# EasyEDA Pro project ProProject_Hauptplatine_ESP32.epro, board PCB1_Link
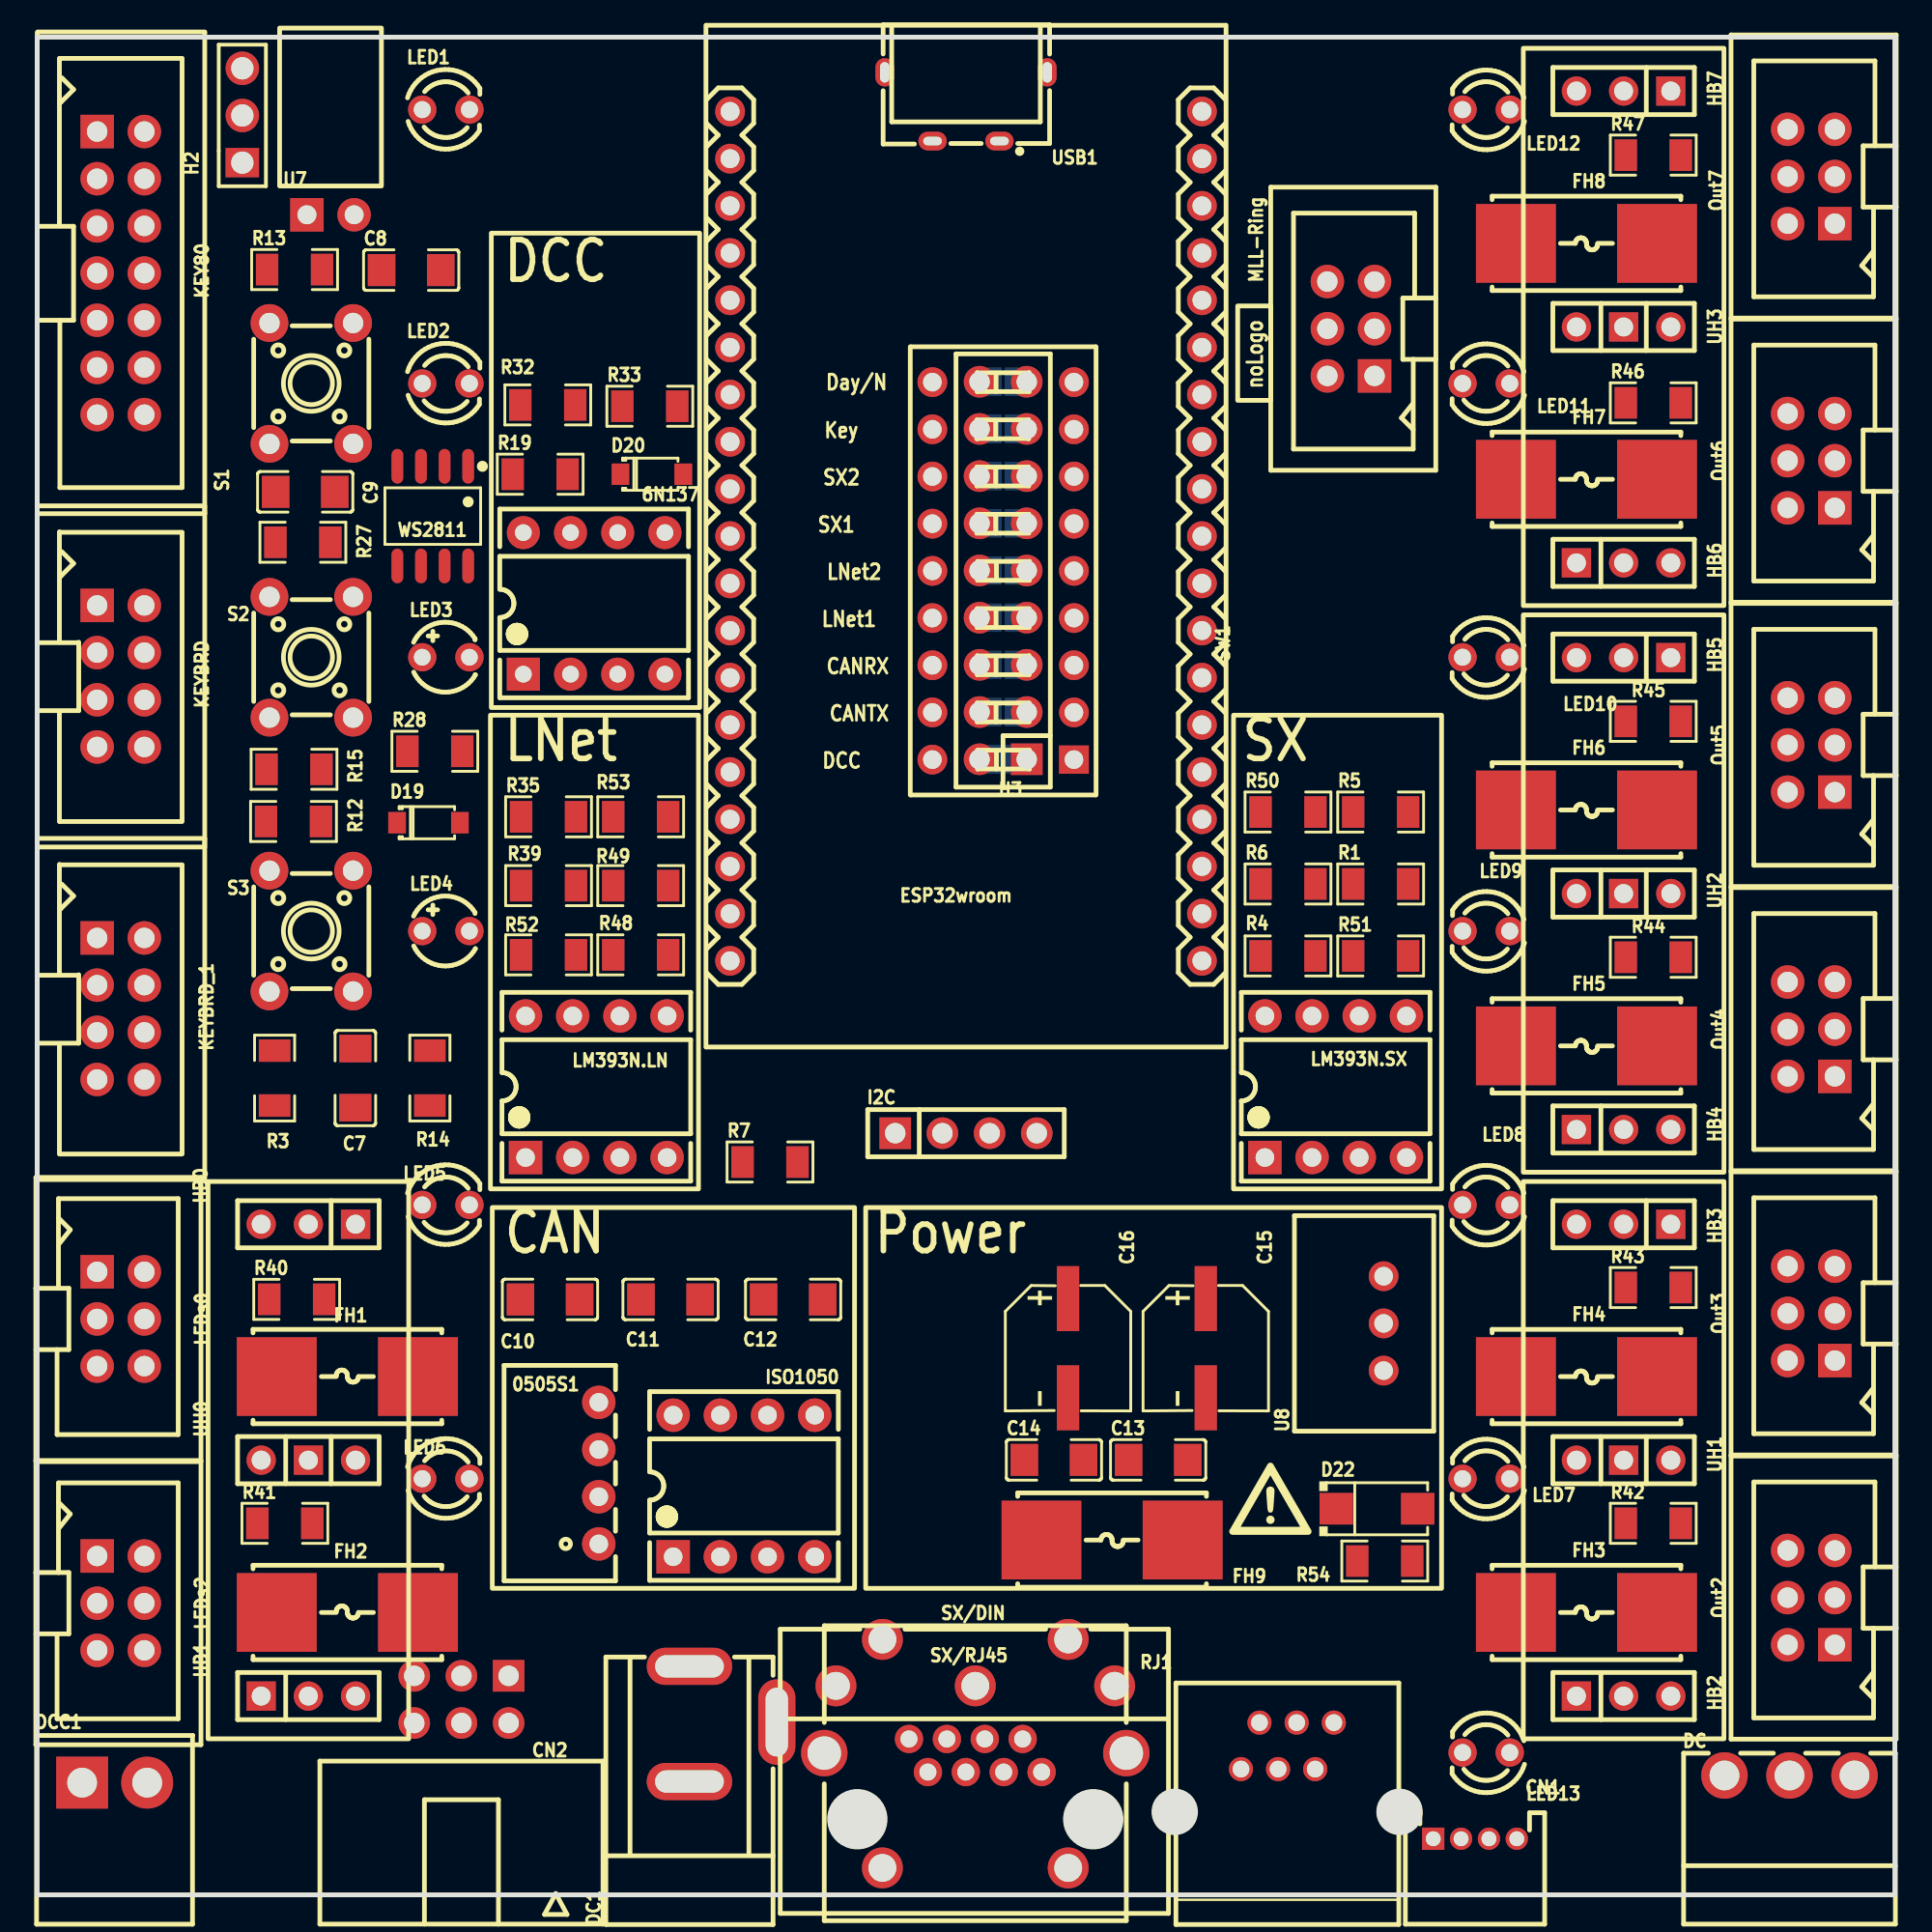
[diagram p10: board, top side]
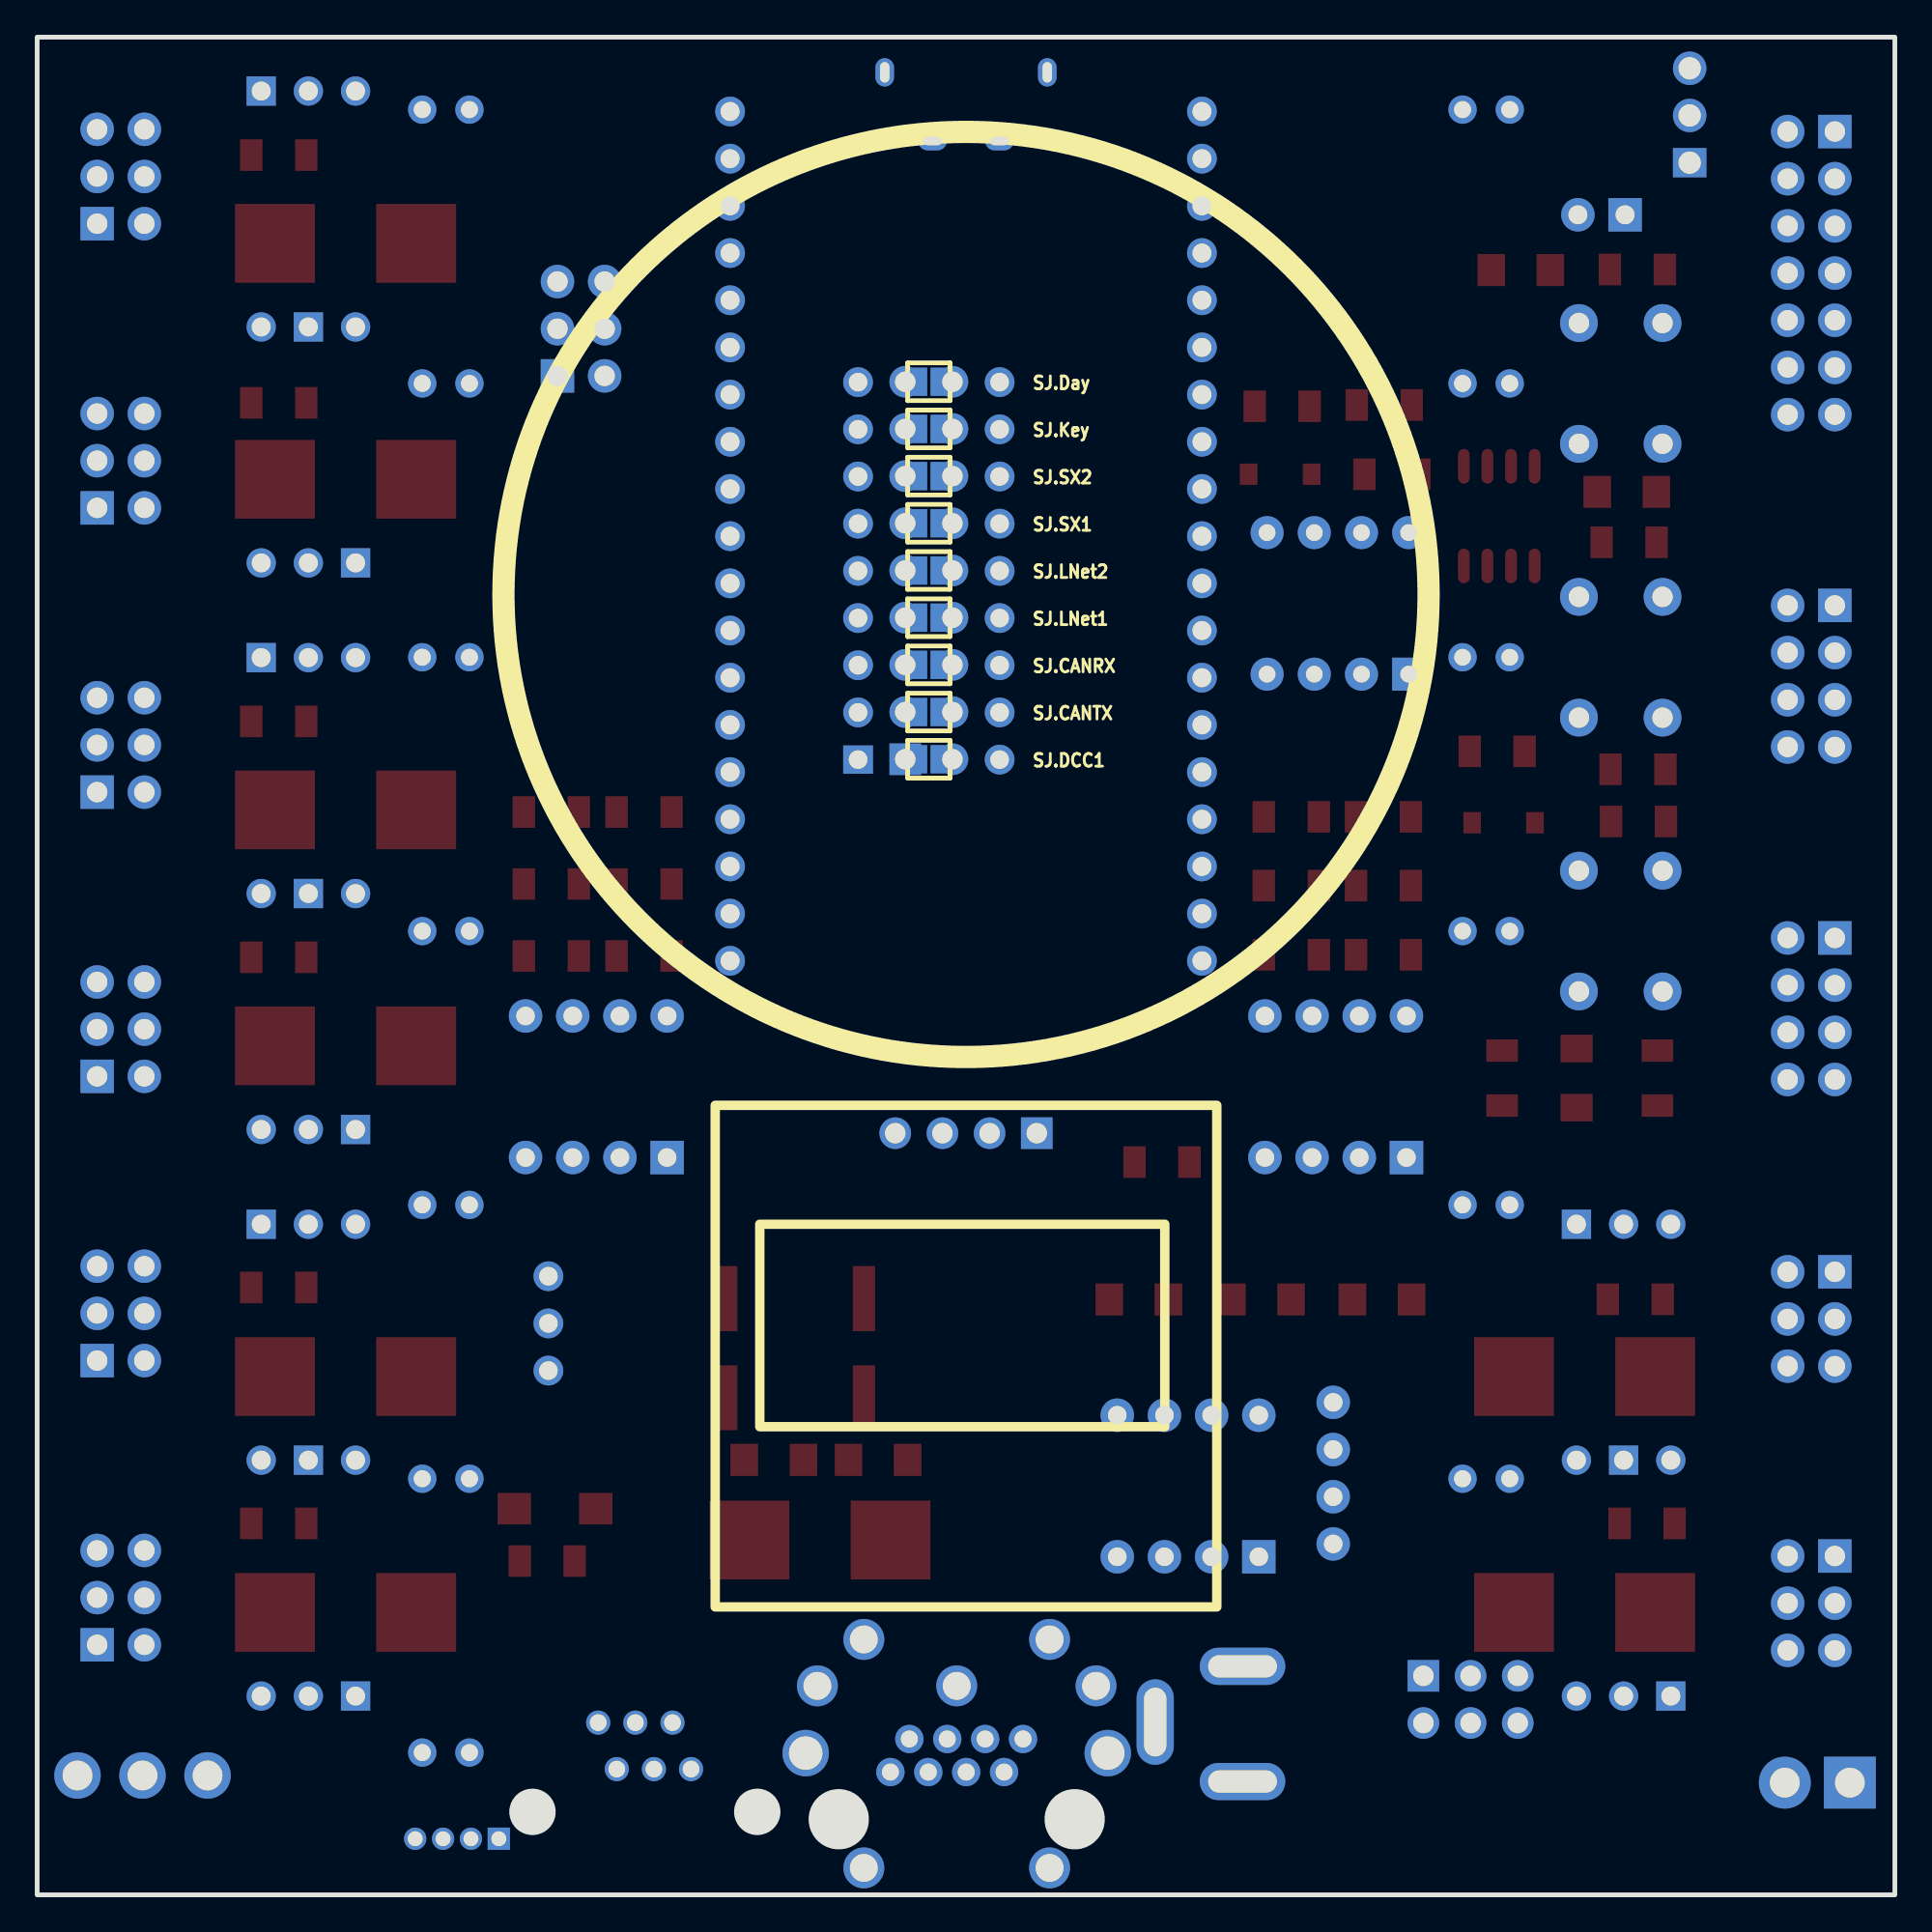
[diagram p11: board, bottom side, seen from below]

Outline 100 x 100 mm; copper layers: Top Layer, Bottom Layer. Coordinates in mm from the lower left corner of the outline.
Outline path: rectangle 0,100 100,0
Stack: Top Layer 0.035mm / Dielectric1 1.51mm FR4 er 4.5 / Bottom Layer 0.035mm

## Design rules (mm)
template: copperThickness1oz
spacing copperThickness1oz (default): track to track 0.132, other pairs 0.152 to 0.3
spacing copperThickness2oz: track to track 0.203, other pairs 0.152 to 0.3
track width copperThickness1oz (default): min 0.127, default 0.254, max 2.54
track width copperThickness2oz: min 0.203, default 0.254, max 2.54
differential pair differentialPair (default): width min 0.127, default 0.254, max 2.54; gap min 0.152, default 0.152
via viaSize (default): diameter min 0.5, default 0.61, max 10; hole min 0.3, default 0.305, max 6.299

## Placement (name value [footprint] x y rotation side)
6N137  6N137  [DIP-8_L9.8-W6.6-P2.54-LS7.6-BL]  29.98 69.52 0 top
0505S1  B0505S-W5R3  [PWRM-TH_BXXXXS-1WR3]  30.23 22.7 90 top
C7  1uF  [C1206]  17.13 43.97 90 top
C8  1uF  [C1206]  20.13 87.46 0 top
C9  1uF  [C1206]  14.43 75.52 180 top
C10  4.7uF  [C1206]  27.61 32.05 180 top
C11  4.7uF  [C1206]  34.09 32.05 180 top
C12  100nF  [C1206]  40.69 32.05 180 top
C13  100uF  [C1206]  60.34 23.41 0 top
C14  100uF  [C1206]  54.73 23.41 0 top
C15  100uF  [CAP-SMD_BD6.3-L6.6-W6.6-FD]  62.91 29.43 270 top
C16  100uF  [CAP-SMD_BD6.3-L6.6-W6.6-FD]  55.49 29.43 270 top
CN1  S4B-ZR(LF)(SN)  [CONN-TH_S4B-ZR-LF-SN]  77.4 3.02 0 top
CN2  2.54-2*3P弯简牛  [IDC-TH_6P-P2.54-H-R2-C3-S2.54]  22.84 10.52 0 top
D19  1N5819W  [SOD-123_L2.8-W1.8-LS3.7-RD]  21.06 57.71 0 top
D20  1N5819W  [SOD-123_L2.8-W1.8-LS3.7-RD]  33.09 76.47 0 top
D22  1N5819  [SMA_L4.4-W2.6-LS5.0-RD]  72.12 20.78 0 top
DC  DB2ERC-3.5-3P-GN  [CONN-TH_3P-P3.50_DB2ERC-3.5-3P-GN]  94.33 6.43 0 top
DC1  DC005  [DC-IN-TH_DC005]  37.46 9.2 90 top
DCC1  DB2ERC-3.5-2P-GN  [CONN-TH_2P-P3.50_DB2ERC-3.5-2P]  4.17 6.04 0 top
ESP32wroom  ESP32-DevKitC  [BULETM-SMD_ESP32-DEVKITC]  50 73.14 90 top
FH1  01550900M  [FUSE-SMD_L9.8-W5.0]  16.7 27.9 180 top
FH2  01550900M  [FUSE-SMD_L9.8-W5.0]  16.7 15.2 180 top
FH3  01550900M  [FUSE-SMD_L9.8-W5.0]  83.4 15.2 0 top
FH4  01550900M  [FUSE-SMD_L9.8-W5.0]  83.4 27.9 0 top
FH5  01550900M  [FUSE-SMD_L9.8-W5.0]  83.4 45.7 0 top
FH6  01550900M  [FUSE-SMD_L9.8-W5.0]  83.4 58.4 0 top
FH7  01550900M  [FUSE-SMD_L9.8-W5.0]  83.4 76.2 0 top
FH8  01550900M  [FUSE-SMD_L9.8-W5.0]  83.4 88.9 0 top
FH9  01550900M  [FUSE-SMD_L9.8-W5.0]  57.86 19.1 0 top
H2  2.54-1*3P针  [HDR-TH_3P-P2.54-V-M-1]  11.04 95.78 90 top
H3  X6521WV-2x09H-C60D30  [HDR-TH_18P-P2.54-V-M-R2-C9-S2.54]  52 71.29 90 top
HB0  PM2.54-1*3  [HDR-TH_3P-P2.54-V-F#2]  14.6 36.1 180 top
HB1  PM2.54-1*3  [HDR-TH_3P-P2.54-V-F#2]  14.6 10.7 0 top
HB2  PM2.54-1*3  [HDR-TH_3P-P2.54-V-F#2]  85.4 10.7 0 top
HB3  PM2.54-1*3  [HDR-TH_3P-P2.54-V-F#2]  85.4 36.1 180 top
HB4  PM2.54-1*3  [HDR-TH_3P-P2.54-V-F#2]  85.4 41.2 0 top
HB5  PM2.54-1*3  [HDR-TH_3P-P2.54-V-F#2]  85.4 66.6 180 top
HB6  PM2.54-1*3  [HDR-TH_3P-P2.54-V-F#2]  85.4 71.7 0 top
HB7  PM2.54-1*3  [HDR-TH_3P-P2.54-V-F#2]  85.4 97.1 180 top
I2C  2.54-1*4P母  [HDR-TH_4P-P2.54-V-F]  50 41 0 top
ISO1050  ISO1050DUBR  [SOIC-8_L9.3-W6.6-P2.54-LS10.4-BL]  38.05 22.01 0 top
KEY80  KEY80  [IDC-TH_14P-P2.54-V-R2-C7-S2.54]  4.5 87.3 270 top
KEYBRD  KEYBRD  [IDC-TH_8P-P2.54-V-R2-C4-S2.54]  4.5 65.6 270 top
KEYBRD_1  KEYBRD_1  [IDC-TH_8P-P2.54-V-R2-C4-S2.54]  4.5 47.7 270 top
LED1  Heartbeat  [LED-TH_BD3.0-P2.54-FD-GREEN]  22 96.1 0 top
LED2  gelb  [LED-TH_BD3.0-P2.54-FD_YELLOW]  22 81.36 0 top
LED3  weiss  [LED-TH_BD3.8-P2.54-FD_WHITE]  22 66.62 0 top
LED4  blau  [LED-TH_BD3.8-P2.54-FD_BLUE]  22 51.88 0 top
LED5  gelb  [LED-TH_BD3.0-P2.54-FD]  22 37.14 0 top
LED6  gelb  [LED-TH_BD3.0-P2.54-FD]  22 22.4 0 top
LED7  gelb  [LED-TH_BD3.0-P2.54-FD]  78 22.4 180 top
LED8  gelb  [LED-TH_BD3.0-P2.54-FD]  78 37.14 180 top
LED9  gelb  [LED-TH_BD3.0-P2.54-FD]  78 51.88 180 top
LED10  gelb  [LED-TH_BD3.0-P2.54-FD]  78 66.62 180 top
LED11  gelb  [LED-TH_BD3.0-P2.54-FD]  78 81.36 180 top
LED12  gelb  [LED-TH_BD3.0-P2.54-FD]  78 96.1 180 top
LED13  gelb  [LED-TH_BD3.0-P2.54-FD]  78 7.66 180 top
LEDs0  BH254V-6P  [IDC-TH_6P-P2.54-V-R2-C3-S2.54]  4.5 31 270 top
LEDs2  BH254V-6P  [IDC-TH_6P-P2.54-V-R2-C3-S2.54]  4.5 15.7 270 top
LM393N.LN  LM393N  [DIP-8_L9.7-W6.4-P2.54-LS7.6-BL]  30.1 43.5 0 top
LM393N.SX  LM393N  [DIP-8_L9.7-W6.4-P2.54-LS7.6-BL]  69.9 43.5 0 top
MLL-Ring  BH254V-6P  [IDC-TH_6P-P2.54-V-R2-C3-S2.54]  70.72 84.31 90 top
Out2  BH254V-6P  [IDC-TH_6P-P2.54-V-R2-C3-S2.54]  95.5 16 90 top
Out3  BH254V-6P  [IDC-TH_6P-P2.54-V-R2-C3-S2.54]  95.5 31.3 90 top
Out4  BH254V-6P  [IDC-TH_6P-P2.54-V-R2-C3-S2.54]  95.5 46.6 90 top
Out5  BH254V-6P  [IDC-TH_6P-P2.54-V-R2-C3-S2.54]  95.5 61.9 90 top
Out6  BH254V-6P  [IDC-TH_6P-P2.54-V-R2-C3-S2.54]  95.5 77.2 90 top
Out7  BH254V-6P  [IDC-TH_6P-P2.54-V-R2-C3-S2.54]  95.5 92.5 90 top
R1  22kΩ  [R1206]  72.32 54.41 0 top
R3  470Ω  [R1206]  12.78 43.97 90 top
R4  8.2kΩ  [R1206]  67.33 50.54 0 top
R5  22kΩ  [R1206]  72.32 58.29 0 top
R6  8.2kΩ  [R1206]  67.33 54.41 0 top
R7  4.7kΩ  [R1206]  39.45 39.45 0 top
R12  100Ω  [R1206]  13.8 57.78 0 top
R13  4.7kΩ  [R1206]  13.86 87.49 0 top
R14  22kΩ  [R1206]  21.14 43.97 90 top
R15  100Ω  [R1206]  13.83 60.59 180 top
R19  1kΩ  [R1206]  27.08 76.47 0 top
R27  22kΩ  [R1206]  14.3 72.81 180 top
R28  100Ω  [R1206]  21.41 61.56 0 top
R32  1kΩ  [R1206]  27.49 80.2 0 top
R33  2kΩ  [R1206]  32.98 80.13 0 top
R35  8.2kΩ  [R1206]  27.53 58.03 0 top
R39  22kΩ  [R1206]  27.53 54.33 0 top
R40  1kΩ  [R1206]  13.97 32.06 0 top
R41  1kΩ  [R1206]  13.33 20 0 top
R42  1kΩ  [R1206]  87 20 0 top
R43  1kΩ  [R1206]  87 32.69 0 top
R44  1kΩ  [R1206]  87 50.47 0 top
R45  1kΩ  [R1206]  87 63.17 0 top
R46  1kΩ  [R1206]  87 80.31 0 top
R47  1kΩ  [R1206]  87 93.65 0 top
R48  47kΩ  [R1206]  32.49 50.6 0 top
R49  10kΩ  [R1206]  32.49 54.33 0 top
R50  33kΩ  [R1206]  67.33 58.29 0 top
R51  33kΩ  [R1206]  72.32 50.54 0 top
R52  150kΩ  [R1206]  27.53 50.6 0 top
R53  220kΩ  [R1206]  32.49 58.03 0 top
R54  1kΩ  [R1206]  72.54 17.97 0 top
RJ1  DS1133-S60BPX  [RJ11-TH_DS1133-S60BPX]  67.3 8.02 90 top
S1  K2-1102DP-X4SW-04  [KEY-TH_4P-L6.2-W6.2-P4.50-LS6.5]  14.76 81.36 90 top
S2  K2-1102DP-X4SW-04  [KEY-TH_4P-L6.2-W6.2-P4.50-LS6.5]  14.76 66.62 90 top
S3  K2-1102DP-X4SW-04  [KEY-TH_4P-L6.2-W6.2-P4.50-LS6.5]  14.76 51.88 90 top
SJ.CANRX  SJ_1.27  [SMD_2P-P1.27-SJ]  52 66.21 180 bottom
SJ.CANTX  SJ_1.27  [SMD_2P-P1.27-SJ]  52 63.67 180 bottom
SJ.Day  SJ_1.27  [SMD_2P-P1.27-SJ]  52 81.45 180 bottom
SJ.DCC1  SJ_1.27  [SMD_2P-P1.27-SJ]  52 61.13 180 bottom
SJ.Key  SJ_1.27  [SMD_2P-P1.27-SJ]  52 78.91 180 bottom
SJ.LNet1  SJ_1.27  [SMD_2P-P1.27-SJ]  52 68.75 180 bottom
SJ.LNet2  SJ_1.27  [SMD_2P-P1.27-SJ]  52 71.29 180 bottom
SJ.SX1  SJ_1.27  [SMD_2P-P1.27-SJ]  52 73.83 180 bottom
SJ.SX2  SJ_1.27  [SMD_2P-P1.27-SJ]  52 76.37 180 bottom
SW1  DS-09RP  [SW-TH_18P-L24.4-W9.9-P2.54-LS7.6]  52 71.27 180 top
SX/DIN  DIN-504B-M10  [CONN-TH_DIN-504B-M10]  50.5 7.6 0 top
SX/RJ45  R-RJ45R08P-B000  [RJ45-TH_R-RJ45R08P-B000]  50.5 7.5 0 top
U7  LDR  [CONN-TH_2P-P2.54_DEALON_DW254W-11-02-85]  15.79 90.44 0 top
U8  LC78_05-3.0  [PWRM-TH_LC78_05-3.0]  72.48 30.76 90 top
UH0  PM2.54-1*3  [HDR-TH_3P-P2.54-V-F]  14.6 23.4 0 top
UH1  PM2.54-1*3  [HDR-TH_3P-P2.54-V-F]  85.4 23.4 0 top
UH2  PM2.54-1*3  [HDR-TH_3P-P2.54-V-F]  85.4 53.9 0 top
UH3  PM2.54-1*3  [HDR-TH_3P-P2.54-V-F]  85.4 84.4 0 top
USB1  KH-TYPE-C-2P  [USB-SMD_KH-TYPE-C-2P]  50 96.26 180 top
WS2811  WS2811  [SOP-8_L4.9-W3.9-P1.27-LS6.0-BL]  21.3 74.22 180 top

## Footprints (pads in the part's own frame, mm; a bottom-side part is the same pattern mirrored in y, then rotated)
BULETM-SMD_ESP32-DEVKITC
  round 1.6 hole 1.02: 1(-22.86,-12.7) 2(-20.32,-12.7) 3(-17.78,-12.7) 4(-15.24,-12.7) 5(-12.7,-12.7) 6(-10.16,-12.7) 7(-7.62,-12.7) 8(-5.08,-12.7) 9(-2.54,-12.7) 10(0,-12.7) 11(2.54,-12.7) 12(5.08,-12.7) 13(7.62,-12.7) 14(10.16,-12.7) 15(12.7,-12.7) 16(15.24,-12.7) 17(17.78,-12.7) 18(20.32,-12.7) 19(22.86,-12.7) 20(-22.86,12.7) 21(-20.32,12.7) 22(-17.78,12.7) 23(-15.24,12.7) 24(-12.7,12.7) 25(-10.16,12.7) 26(-7.62,12.7) 27(-5.08,12.7) 28(-2.54,12.7) 29(0,12.7) 30(2.54,12.7) 31(5.08,12.7) 32(7.62,12.7) 33(10.16,12.7) 34(12.7,12.7) 35(15.24,12.7) 36(17.78,12.7) 37(20.32,12.7) 38(22.86,12.7)
C1206
  rect 1.485x1.728 smd: 1(-1.593,0) 2(1.593,0)
CAP-SMD_BD6.3-L6.6-W6.6-FD
  rect 3.5x1.2 smd: 1(-2.67,0) 2(2.67,0)
CONN-TH_2P-P2.54_DEALON_DW254W-11-02-85
  rect 1.8x1.8 hole 1.02: 1(-1.27,0)
  round 1.8 hole 1.02: 2(1.27,0)
CONN-TH_2P-P3.50_DB2ERC-3.5-2P
  round 2.794 hole 1.6: 1(1.75,0)
  rect 2.794x2.794 hole 1.6: 2(-1.75,0)
CONN-TH_3P-P3.50_DB2ERC-3.5-3P-GN
  round 2.5 hole 1.6: 1(-3.5,0) 2(0,0) 3(3.5,0)
CONN-TH_DIN-504B-M10
  round 2.2 hole 1.5: 1(-7.5,3.65) 2(0,3.65) 3(7.5,3.65) 4(-5,6.15) 5(5,6.15) 6(-5,-6.15) 7(5,-6.15)
CONN-TH_S4B-ZR-LF-SN
  rect 1.2x1.2 hole 0.8: 1(-2.25,0)
  round 1.2 hole 0.8: 2(-0.75,0) 3(0.75,0) 4(2.25,0)
DC-IN-TH_DC005
  oval 2x4.6 hole 1.2x3.7: 1(3.1,2.35) 2(-3.1,2.35)
  oval 4.6x2 hole 3.7x1.2: 3(0.1,-2.35)
DIP-8_L9.7-W6.4-P2.54-LS7.6-BL
  rect 1.8x1.8 hole 1: 1(-3.81,-3.81)
  round 1.8 hole 1: 2(-1.27,-3.81) 3(1.27,-3.81) 4(3.81,-3.81) 5(3.81,3.81) 6(1.27,3.81) 7(-1.27,3.81) 8(-3.81,3.81)
DIP-8_L9.8-W6.6-P2.54-LS7.6-BL
  rect 1.778x1.778 hole 0.9: 1(-3.81,-3.81)
  round 1.778 hole 0.9: 2(-1.27,-3.81) 3(1.27,-3.81) 4(3.81,-3.81) 5(3.81,3.81) 6(1.27,3.81) 7(-1.27,3.81) 8(-3.81,3.81)
FUSE-SMD_L9.8-W5.0
  rect 4.3x4.24 smd: 1(-3.8,0) 2(3.8,0)
HDR-TH_3P-P2.54-V-F
  round 1.575 hole 1.02: 1(-2.54,0) 3(2.54,0)
  rect 1.575x1.575 hole 1.02: 2(0,0)
HDR-TH_3P-P2.54-V-F#2
  rect 1.575x1.575 hole 1.02: 1(-2.54,0)
  round 1.575 hole 1.02: 2(0,0) 3(2.54,0)
HDR-TH_3P-P2.54-V-M-1
  rect 1.575x1.8 hole 1.2: 1(-2.54,0)
  round 1.8 hole 1.2: 2(0,0) 3(2.54,0)
HDR-TH_4P-P2.54-V-F
  rect 1.7x1.7 hole 1.1: 1(-3.81,0)
  round 1.7 hole 1.1: 2(-1.27,0) 3(1.27,0) 4(3.81,0)
HDR-TH_18P-P2.54-V-M-R2-C9-S2.54
  rect 1.7x1.7 hole 1.1: 1(-10.16,-1.27)
  round 1.7 hole 1.1: 2(-7.62,-1.27) 3(-5.08,-1.27) 4(-2.54,-1.27) 5(0,-1.27) 6(2.54,-1.27) 7(5.08,-1.27) 8(7.62,-1.27) 9(10.16,-1.27) 10(10.16,1.27) 11(7.62,1.27) 12(5.08,1.27) 13(2.54,1.27) 14(0,1.27) 15(-2.54,1.27) 16(-5.08,1.27) 17(-7.62,1.27) 18(-10.16,1.27)
IDC-TH_6P-P2.54-H-R2-C3-S2.54
  rect 1.7x1.7 hole 1.1: 1(2.54,1.27)
  round 1.7 hole 1.1: 2(2.54,-1.27) 3(0,1.27) 4(0,-1.27) 5(-2.54,1.27) 6(-2.54,-1.27)
IDC-TH_6P-P2.54-V-R2-C3-S2.54
  rect 1.8x1.8 hole 1.1: 1(-2.54,-1.27)
  round 1.8 hole 1.1: 2(-2.54,1.27) 3(0,-1.27) 4(0,1.27) 5(2.54,-1.27) 6(2.54,1.27)
IDC-TH_8P-P2.54-V-R2-C4-S2.54
  rect 1.801x1.801 hole 1.1: 1(-3.81,-1.27)
  round 1.801 hole 1.1: 2(-3.81,1.27) 3(-1.27,-1.27) 4(-1.27,1.27) 5(1.27,-1.27) 6(1.27,1.27) 7(3.81,-1.27) 8(3.81,1.27)
IDC-TH_14P-P2.54-V-R2-C7-S2.54
  rect 1.8x1.8 hole 1.1: 1(-7.62,-1.27)
  round 1.8 hole 1.1: 2(-7.62,1.27) 3(-5.08,-1.27) 4(-5.08,1.27) 5(-2.54,-1.27) 6(-2.54,1.27) 7(0,-1.27) 8(0,1.27) 9(2.54,-1.27) 10(2.54,1.27) 11(5.08,-1.27) 12(5.08,1.27) 13(7.62,-1.27) 14(7.62,1.27)
KEY-TH_4P-L6.2-W6.2-P4.50-LS6.5
  round 2.032 hole 1.1: 1(-3.251,2.251) 2(3.251,2.251) 3(-3.251,-2.251) 4(3.251,-2.251)
LED-TH_BD3.0-P2.54-FD
  round 1.524 hole 0.914: 1(-1.27,0) 2(1.27,0)
LED-TH_BD3.0-P2.54-FD-GREEN
  round 1.524 hole 0.914: 1(-1.27,0) 2(1.27,0)
LED-TH_BD3.0-P2.54-FD_YELLOW
  round 1.524 hole 0.914: 1(-1.27,0) 2(1.27,0)
LED-TH_BD3.8-P2.54-FD_BLUE
  round 1.524 hole 0.9: 1(-1.27,0) 2(1.27,0)
LED-TH_BD3.8-P2.54-FD_WHITE
  round 1.524 hole 0.9: 1(-1.27,0) 2(1.27,0)
PWRM-TH_BXXXXS-1WR3
  round 1.8 hole 1: 1(-3.81,0) 2(-1.27,0) 3(1.27,0) 4(3.81,0)
PWRM-TH_LC78_05-3.0
  round 1.6 hole 1: 1(-2.54,0) 2(0,0) 3(2.54,0)
R1206
  rect 1.208x1.701 smd: 1(-1.479,0) 2(1.479,0)
RJ11-TH_DS1133-S60BPX
  round 1.3 hole 0.9: 1(1.251,-2.499) 2(-1.251,-1.498) 3(1.251,-0.5) 4(-1.251,0.5) 5(1.251,1.501) 6(-1.251,2.499)
RJ45-TH_R-RJ45R08P-B000
  round 1.524 hole 0.914: 1(3.57,-0.89) 2(2.55,0.89) 3(1.53,-0.89) 4(0.51,0.89) 5(-0.51,-0.89) 6(-1.53,0.89) 7(-2.55,-0.89) 8(-3.57,0.89)
  round 2.5 hole 1.8: 9(-8.13,0.13) 10(8.13,0.13)
SMA_L4.4-W2.6-LS5.0-RD
  rect 1.8x1.7 smd: 1(-2.192,0) 2(2.192,0)
SMD_2P-P1.27-SJ
  rect 0.762x1.524 smd: 1(-0.47,0) 2(0.47,0)
SOD-123_L2.8-W1.8-LS3.7-RD
  rect 0.95x1.15 smd: 1(-1.692,0) 2(1.692,0)
SOIC-8_L9.3-W6.6-P2.54-LS10.4-BL
  rect 1.8x1.8 hole 1: 1(-3.81,-3.81)
  round 1.8 hole 1: 2(-1.27,-3.81) 3(1.27,-3.81) 4(3.81,-3.81) 5(3.81,3.81) 6(1.27,3.81) 7(-1.27,3.81) 8(-3.81,3.81)
SOP-8_L4.9-W3.9-P1.27-LS6.0-BL
  oval 0.63x1.865 smd: 1(-1.905,-2.683) 2(-0.635,-2.683) 3(0.635,-2.683) 4(1.905,-2.683) 5(1.905,2.683) 6(0.635,2.683) 7(-0.635,2.683) 8(-1.905,2.683)
SW-TH_18P-L24.4-W9.9-P2.54-LS7.6
  rect 1.6x1.524 hole 1: 1(-3.81,10.16)
  round 1.6 hole 1: 2(-3.81,7.62) 3(-3.81,5.08) 4(-3.81,2.54) 5(-3.81,0) 6(-3.81,-2.54) 7(-3.81,-5.08) 8(-3.81,-7.62) 9(-3.81,-10.16) 10(3.81,-10.16) 11(3.81,-7.62) 12(3.81,-5.08) 13(3.81,-2.54) 14(3.81,0) 15(3.81,2.54) 16(3.81,5.08) 17(3.81,7.62) 18(3.81,10.16)
USB-SMD_KH-TYPE-C-2P
  oval 1.524x1 hole 1x0.45: 1(-1.8,1.85) 2(1.8,1.85)
  oval 1x1.524 hole 0.5x1.1: 3(4.375,-1.85) 4(-4.375,-1.85)

## Nets
As in the schematic, except:
+5V: 6N137.8 0505S1.2 C11.2 C14.2 C16.1 D19.2 D22.2 DC.1 FH1.1 FH2.1 FH3.1 FH4.1 FH5.1 FH6.1 FH7.1 FH8.1 I2C.3 KEY80.13 KEYBRD.3 KEYBRD_1.3 LED2.1 LED3.1 LED4.1 LED5.1 LED6.1 LED7.1 LED8.1 LED9.1 LED10.1 LED11.1 LED12.1 MLL-Ring.1 R13.2 R14.1 R27.1 R49.2 R50.2 U8.3 UH0.2 UH1.2 UH2.2 UH3.2 USB1.1
LED7I: ESP32wroom.33 R28.2
$1N113344: FH1.2 LEDs0.1 R40.2

Pads without a net: 6N137 1 4 7; CN1 4; CN2 1 6; ESP32wroom 2 3 4 6 8 14 16 17 18 19 22 23 24 25 26 34 36 37 38; H2 2 3; LM393N.LN 5 7; MLL-Ring 6; RJ1 1 6; SX/DIN 1 2 3 4 5 6 7; SX/RJ45 1 2 3 4 5 6 7 8 9 10; USB1 3 4; WS2811 7

## Text on the board
Top Silkscreen Layer: SX1 | Key | SX2 | DCC | LNet1 | LNet2 | Day/N | CANRX | CANTX | noLogo | LNet | CAN | Power | SX
